# Altium schematic sheet alt_sche.SchDoc
size 558 x 431 mm; SheetNumber: 1; SheetTotal: 1
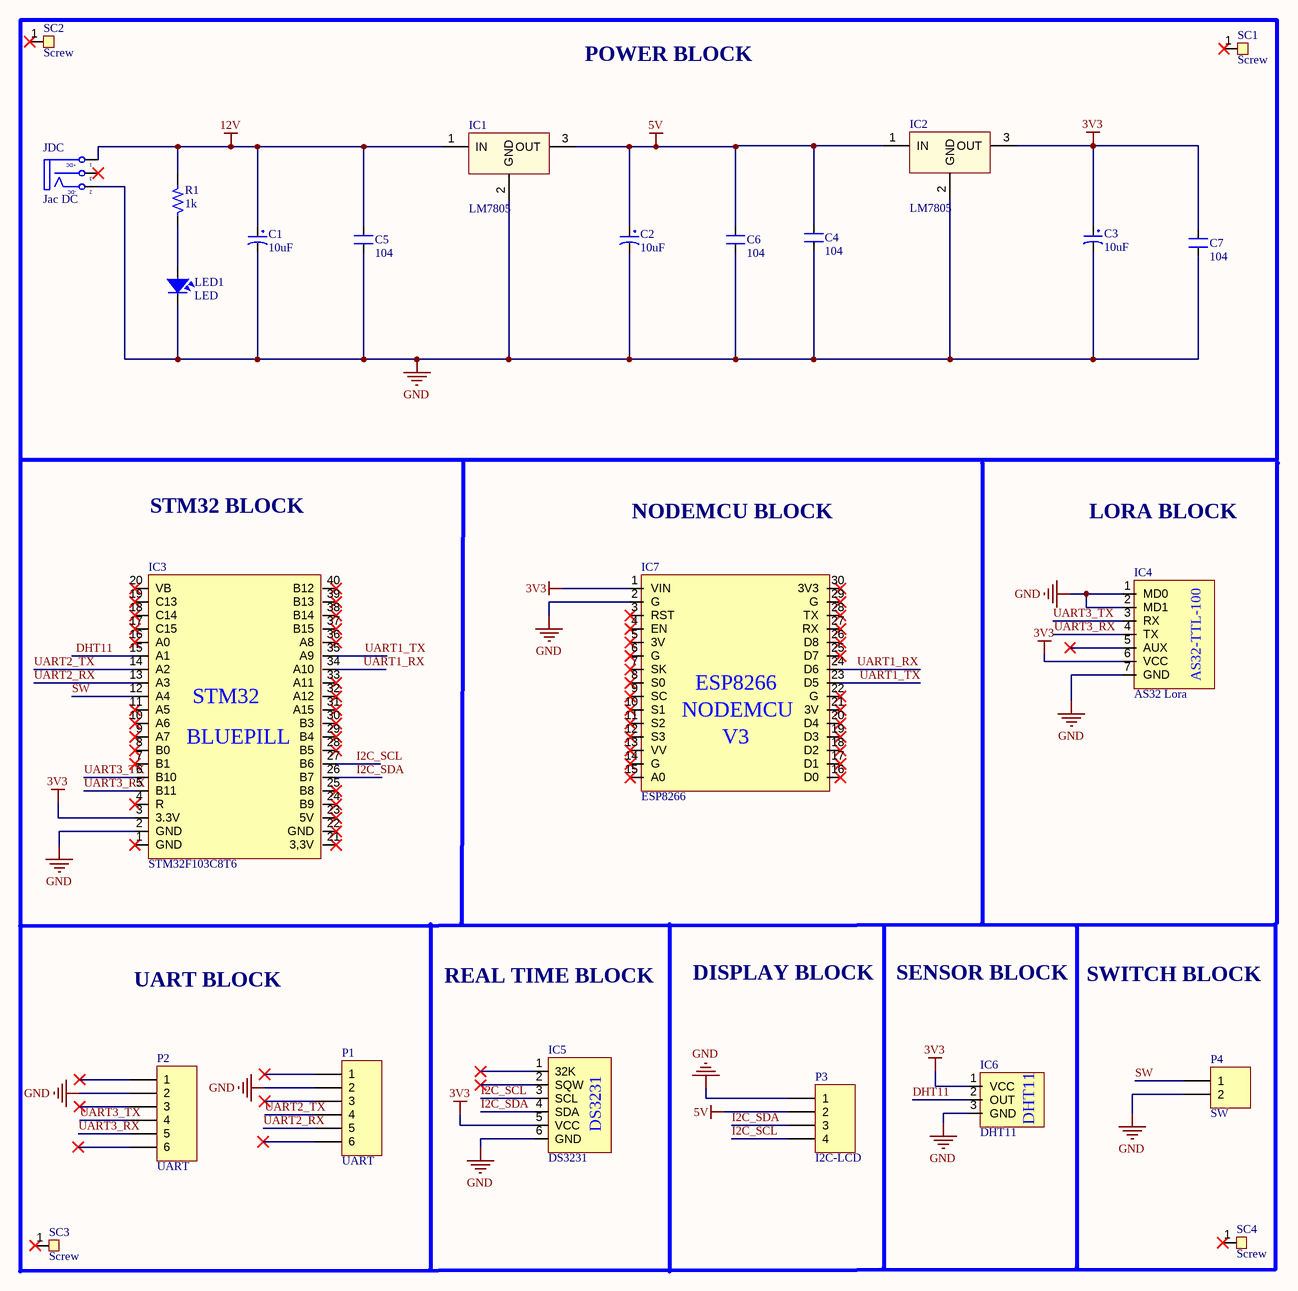
[diagram p0: alt_sche.SchDoc]

## Parts
C1  10uF  [CP1/2]
C2  10uF  [CP1/2]
C3  10uF  [CP1/2]
C4  104  [CN2]
C5  104  [CN2]
C6  104  [CN2]
C7  104  [CN2]
IC1  LM7805  [QTO-220]
IC2  LM7805  [QTO-220]
IC3  STM32F103C8T6  [STM32_BLUEPILL]
IC4  AS32 Lora  [LORA]
IC5  DS3231  [DS3231]
IC6  DHT11  [DHT11]
IC7  ESP8266  [ESP8266]
JDC  Jac DC  [DC-IN]
LED1  LED  [LED-3]
P1  UART  [HDR1X6]
P2  UART  [HDR1X6]
P3  I2C-LCD  [HDR1X4]
P4  SW  [HDR1X2]
R1  1k  [R1/4W]
SC1  Screw  [Screw 3 small]
SC2  Screw  [Screw 3 small]
SC3  Screw  [Screw 3 small]
SC4  Screw  [Screw 3 small]

## Nets
3V3: C3.1 C7.2 IC2.3(OUT) IC3.3(3.3V) IC4.6(VCC) IC5.5(VCC) IC6.1(VCC) IC7.1(VIN)
5V: C2.1 C4.2 C6.2 IC1.3(OUT) IC2.1(IN) P3.2
12V: C1.1 C5.2 IC1.1(IN) JDC.1(T) R1.2
GND: C1.2 C2.2 C3.2 C4.1 C5.1 C6.1 C7.1 IC1.2(GND) IC2.2(GND) IC3.2(GND) IC4.1(MD0) IC4.2(MD1) IC4.7(GND) IC5.6(GND) IC6.3(GND) IC7.2(G) JDC.2(TN) LED1.2 P1.2 P2.2 P3.1 P4.2
DHT11: IC3.15(A1) IC6.2(OUT)
I2C_SCL: IC3.27(B6) IC5.3(SCL) P3.4
I2C_SDA: IC3.26(B7) IC5.4(SDA) P3.3
SW: IC3.12(A4) P4.1
UART1_RX: IC3.34(A10) IC7.24(D6)
UART1_TX: IC3.35(A9) IC7.23(D5)
UART2_RX: IC3.13(A3) P1.5
UART2_TX: IC3.14(A2) P1.4
UART3_RX: IC3.5(B11) IC4.4(TX) P2.5
UART3_TX: IC3.6(B10) IC4.3(RX) P2.4
NetLED1_1: LED1.1 R1.1

Not connected (* = marked no-connect by the designer): IC3 1(GND)* 4(R)* 7(B1)* 8(B0)* 9(A7)* 10(A6)* 11(A5)* 16(A0)* 17(C15)* 18(C14)* 19(C13)* 20(VB)* 21(3,3V)* 22(GND)* 23(5V)* 24(B9)* 25(B8)* 28(B5)* 29(B4)* 30(B3)* 31(A15)* 32(A12)* 33(A11)* 36(A8)* 37(B15)* 38(B14)* 39(B13)* 40(B12)*; IC4 5(AUX)*; IC5 1(32K)* 2(SQW)*; IC7 3(RST)* 4(EN)* 5(3V)* 6(G)* 7(SK)* 8(S0)* 9(SC)* 10(S1)* 11(S2)* 12(S3)* 13(VV)* 14(G)* 15(A0)* 16(D0)* 17(D1)* 18(D2)* 19(D3)* 20(D4)* 21(3V)* 22(G)* 25(D7)* 26(D8)* 27(RX)* 28(TX)* 29(G)* 30(3V3)*; JDC 3(S)*; P1 1* 3* 6*; P2 1* 3* 6*; SC1 1*; SC2 1*; SC3 1*; SC4 1*

## Notes on the sheet
- POWER BLOCK
- STM32 BLOCK
- NODEMCU BLOCK
- LORA BLOCK
- UART BLOCK
- REAL TIME BLOCK
- DISPLAY BLOCK
- SENSOR BLOCK
- SWITCH BLOCK
- DWG. NO.
- REV.
- SHT.
- REVISION
- DESCRIPTION
- DATE
- APPROVED
- THIS DOCUMENT AND THE DATA DISCLOSED HEREIN OR HEREWITH IS THE PROPERTY OF ALTIUM LIMITED AND MAY BE FREELY DISTRIBUTED IN WHOLE. NO RIGHTS ARE RESERVED OR EXPRESS OR IMPLIED WARANTEE GIVEN.
- ENG:
- DSN:
- APPROVALS
- PROJECT
- DOCUMENT REVISION:
- DESIGN ITEM:
- CHK:
- BOM:
- REFERENCE DOCUMENTS
- PROJECT REVISION:
- TITLE
- FAB DWG:
- PCB DWG:
- ASSY DWG:
- SCALE:
- SIZE
- C
- CAGE CODE
- FILE NAME
- DWG NO.
- SHEET
- OF
- REV
- (in symbol DCIN) +DC; -DC
- (in symbol ESP8266) NODEMCU; V3
- (in symbol LORA) AS32-TTL-100
- (in symbol STM32_BLUEPILL) STM32; BLUEPILL

## Library data of the parts
C1-C3 = CP1: Cap P  0,1uF < 22uF , 16 - 50V; Value: 10uF/50V; Description 1: 10 => 220uF/6,3V/10V - 10uF => 100uF/16V; Description 2: 0,1uF => 33uF/50V - 10uF => 22uF/63V; Description 3: 0,47uF => 10uF/100V
C4-C7 = CN2: Cap np 104 => 105pF; Value: 0.1uF
IC1 IC2 = LM78xx: On ap +, from + 5 to + 24VDC; Value: LM7805
IC3 = STM32_BLUEPILL
IC4 = LORA
JDC = DCIN: Jac DC input; Value: Jac DC
LED1 = LED: LED Single colour Green and Red; Value: LED 3 ly Single Colour
P1 P2 = Header 6: Header, 6-Pin; LatestRevisionDate: 17-Jul-2002; LatestRevisionNote: Re-released for DXP Platform.; Publisher: Altium Limited
P3 = Header 4: Header, 4-Pin; LatestRevisionDate: 17-Jul-2002; LatestRevisionNote: Re-released for DXP Platform.; Publisher: Altium Limited
P4 = Header 2: Header, 2-Pin; LatestRevisionDate: 17-Jul-2002; LatestRevisionNote: Re-released for DXP Platform.; Publisher: Altium Limited
R1 = R: Resistor 1/4W; Value: R1/4W - 1K
SC1-SC4 = screw 3 small